# Altium project PROJECT_CONTROL_DC.PrjPCB
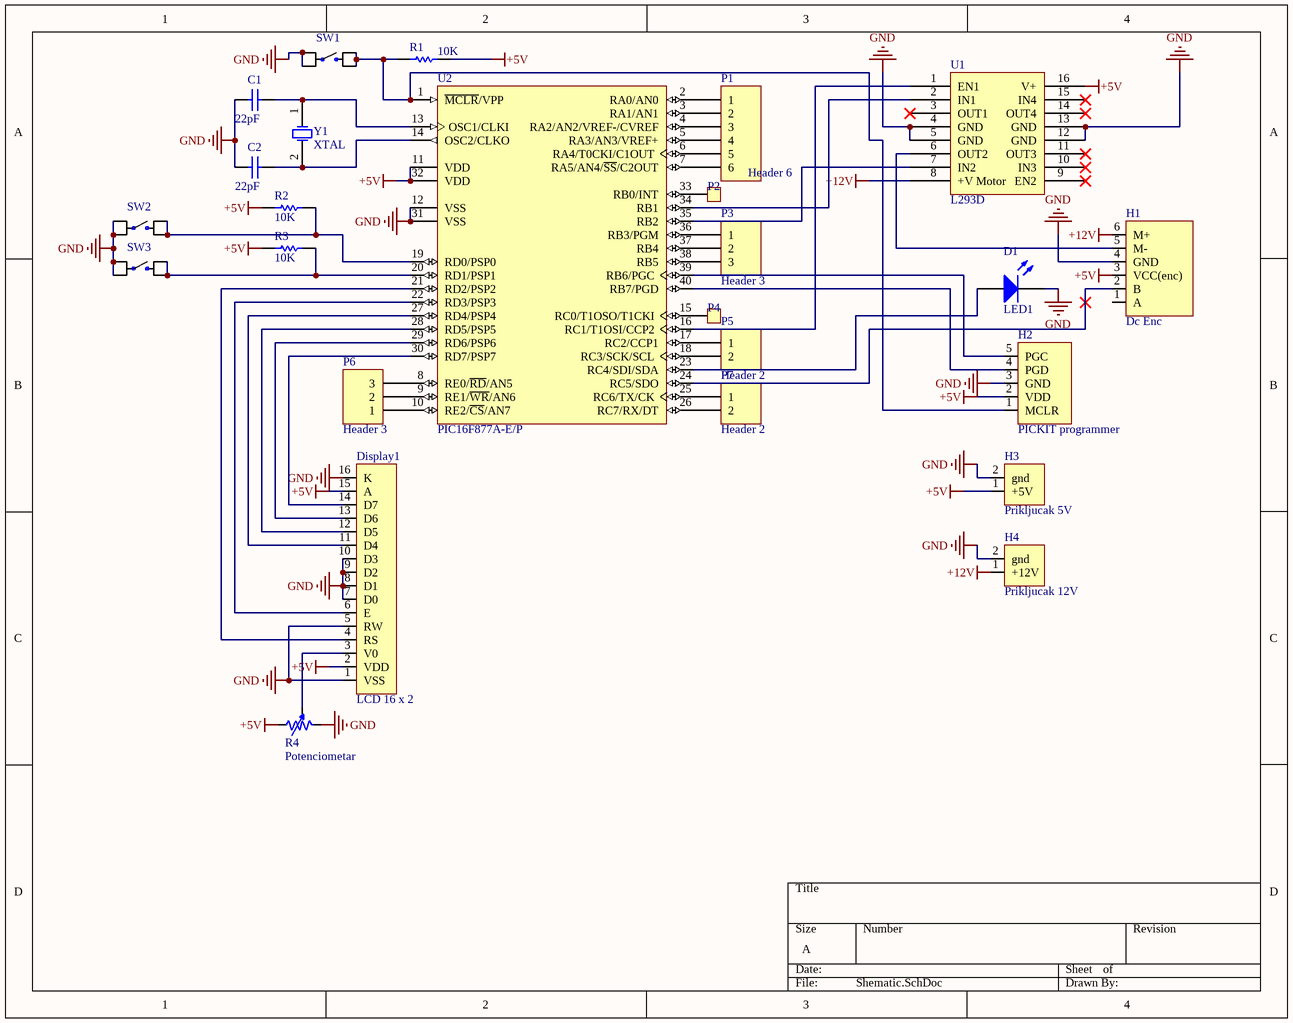
[diagram p0: Shematic.SchDoc]
1 sheet, 25 parts. Net scope: global (net labels, ports and power ports of the same name join across sheets).
Board file: PCB.PcbDoc

## Sheet Shematic.SchDoc
size A

### Parts
C1  value 22pF  [RAD-0.3]  (hidden comment: Cap)
C2  value 22pF  [RAD-0.3]  (hidden comment: Cap)
D1  LED1  [LED-1]
Display1  LCD 16 x 2  [LCD16x2]
H1  Dc Enc
H2  PICKIT programmer  [Pickit]
H3  Prikljucak 5V  [H 5V]
H4  Prikljucak 12V  [H 12V]
P1  Header 6  [HDR1X6]
P2  Header 1  [Header 1]  (value not drawn)
P3  Header 3  [HDR1X3]
P4  Header 1  [Header 1]  (value not drawn)
P5  Header 2  [HDR1X2]
P6  Header 3  [HDR1X3]
P7  Header 2  [HDR1X2]
R1  value 10K  [AXIAL-0.3]  (hidden comment: Res1)
R2  value 10K  [AXIAL-0.3]  (hidden comment: Res1)
R3  value 10K  [AXIAL-0.3]  (hidden comment: Res1)
R4  Potenciometar  [ADJ_RES]
SW1  2-1437565-8  [*SW_SMD_2-1437565-8_4_4.50_6.00_6.00_5.00]  (value not drawn)
SW2  2-1437565-8  [*SW_SMD_2-1437565-8_4_4.50_6.00_6.00_5.00]  (value not drawn)
SW3  2-1437565-8  [*SW_SMD_2-1437565-8_4_4.50_6.00_6.00_5.00]  (value not drawn)
U1  L293D  [*DIP880W50P254L2000H510Q16]
U2  PIC16F877A-E/P  [*DIP254P1524X483-40]
Y1  XTAL  [R38]

### Nets
+5V: Display1.2(VDD) Display1.15(A) H1.3(VCC(enc)) H2.2(VDD) H3.1(+5V) R1.2 R2.2 R3.2 R4.1 U1.16(V+) U2.11(VDD) U2.32(VDD)
+12V: H1.6(M+) H4.1(+12V) U1.8(+V_Motor)
GND: C1.1 C2.1 D1.2(K) Display1.1(VSS) Display1.5(RW) Display1.7(D0) Display1.8(D1) Display1.9(D2) Display1.10(D3) Display1.16(K) H1.4(GND) H2.3(GND) H3.2(gnd) H4.2(gnd) R4.2 SW1.1 SW1.2 SW2.1 SW2.2 SW3.1 SW3.2 U1.4(GND) U1.5(GND) U1.12(GND) U1.13(GND) U2.12(VSS) U2.31(VSS)
NetC1_2: C1.2 U2.13(OSC1/CLKI) Y1.1(OSC1)
NetC2_2: C2.2 U2.14(OSC2/CLKO) Y1.2(OSC2)
NetD1_1: D1.1(A) U2.23(RC4/SDI/SDA)
NetDisplay1_3: Display1.3(V0) R4.3
NetDisplay1_4: Display1.4(RS) U2.21(RD2/PSP2)
NetDisplay1_6: Display1.6(E) U2.22(RD3/PSP3)
NetDisplay1_11: Display1.11(D4) U2.27(RD4/PSP4)
NetDisplay1_12: Display1.12(D5) U2.28(RD5/PSP5)
NetDisplay1_13: Display1.13(D6) U2.29(RD6/PSP6)
NetDisplay1_14: Display1.14(D7) U2.30(RD7/PSP7)
NetH1_2: H1.2(B) U2.24(RC5/SDO)
NetH1_5: H1.5(M-) U1.6(OUT2)
NetH2_1: H2.1(MCLR) R1.1 SW1.3 SW1.4 U2.1(~{MCLR}/VPP)
NetH2_4: H2.4(PGD) U2.40(RB7/PGD)
NetH2_5: H2.5(PGC) U2.39(RB6/PGC)
NetP1_1: P1.1 U2.2(RA0/AN0)
NetP1_2: P1.2 U2.3(RA1/AN1)
NetP1_3: P1.3 U2.4(RA2/AN2/VREF-/CVREF)
NetP1_4: P1.4 U2.5(RA3/AN3/VREF+)
NetP1_5: P1.5 U2.6(RA4/T0CKI/C1OUT)
NetP1_6: P1.6 U2.7(RA5/AN4/~{SS}/C2OUT)
NetP2_1: P2.1 U2.33(RB0/INT)
NetP3_1: P3.1 U2.36(RB3/PGM)
NetP3_2: P3.2 U2.37(RB4)
NetP3_3: P3.3 U2.38(RB5)
NetP4_1: P4.1 U2.15(RC0/T1OSO/T1CKI)
NetP5_1: P5.1 U2.17(RC2/CCP1)
NetP5_2: P5.2 U2.18(RC3/SCK/SCL)
NetP6_1: P6.1 U2.10(RE2/~{CS}/AN7)
NetP6_2: P6.2 U2.9(RE1/~{WR}/AN6)
NetP6_3: P6.3 U2.8(RE0/~{RD}/AN5)
NetP7_1: P7.1 U2.25(RC6/TX/CK)
NetP7_2: P7.2 U2.26(RC7/RX/DT)
NetR2_1: R2.1 SW2.3 SW2.4 U2.19(RD0/PSP0)
NetR3_1: R3.1 SW3.3 SW3.4 U2.20(RD1/PSP1)
NetU1_1: U1.1(EN1) U2.16(RC1/T1OSI/CCP2)
NetU1_2: U1.2(IN1) U2.34(RB1)
NetU1_7: U1.7(IN2) U2.35(RB2)

Not connected (* = marked no-connect by the designer): H1 1(A); U1 3(OUT1)* 9(EN2)* 10(IN3)* 11(OUT3)* 14(OUT4)* 15(IN4)*

### Library data of the parts
C1 C2 = Cap: Capacitor; Published: 8-Jun-2000; LatestRevisionDate: 17-Jul-2002; LatestRevisionNote: Re-released for DXP Platform.; PackageReference: RAD-0.3; Publisher: Altium Limited; PackageDescription: Radial Cap, Thru-Hole; 2 Leads; 0.3 in Pin Spacing
D1 = LED1: Typical RED GaAs LED; Published: 8-Jun-2000; LatestRevisionDate: 08-Jul-2005; LatestRevisionNote: Mech Layer 1 removed.; PackageReference: LED-1; Publisher: Altium Limited; PackageDescription: LED; 2 Leads
H1 = Header DC & ENC
H2 = PICKIT HEADER
H3 = Header 5V
H4 = Header 12V
P1 = Header 6: Header, 6-Pin; LatestRevisionDate: 17-Jul-2002; LatestRevisionNote: Re-released for DXP Platform.; Publisher: Altium Limited
P3 P6 = Header 3: Header, 3-Pin; LatestRevisionDate: 17-Jul-2002; LatestRevisionNote: Re-released for DXP Platform.; Publisher: Altium Limited
P5 P7 = Header 2: Header, 2-Pin; LatestRevisionDate: 17-Jul-2002; LatestRevisionNote: Re-released for DXP Platform.; Publisher: Altium Limited
R1-R3 = Res1: Resistor; Published: 8-Jun-2000; LatestRevisionDate: 17-Jul-2002; LatestRevisionNote: Re-released for DXP Platform.; PackageReference: AXIAL-0.3; Publisher: Altium Limited; PackageDescription: Axial Device, Thru-Hole; 2 Leads; 0.3 in Pin Spacing
R4 = ADJ_RES
SW1-SW3 = 2-1437565-8: Tactile Switch SPST-NO Top Actuated Surface Mount; Configuration_Pole-Throw: Single Pole - Single Throw; MF: TE Connectivity; Contact_Current_Rating: 50 mA; Package: None; TE_purchase_URL: https://www.te.com/usa-en/product-2-1437565-8.html?te_bu=Cor&te_type=disp&te_campaign=seda_glo_cor-seda-global-disp-prtnr-fy19-seda-model-bom-cta_sma-317_1&elqCampaignId=32493; MP: 2-1437565-8; Price: None; SnapEDA_Link: https://www.snapeda.com/parts/2-1437565-8/TE%20Connectivity%20ALCOSWITCH%20Switches/view-part/455292/?ref=snap; Availability: Unavailable; Value: *
U1 = L293D: Motor Driver
U2 = PIC16F877A-E/P: Enhanced FLASH Microcontroller, 8K (x14-Bit words) FLASH, 368 Bytes RAM, 40-Pin PDIP, Standard VDD Range, Extended Temperature; ComponentAvailability: Unknown. Contact manufacturer to determine status.; Published: 11-Oct-2004; LatestRevisionDate: 29-Jan-2009; LatestRevisionNote: Sch. layout revised. 3D Model Removed.; DatasheetVersion: revB, Oct-2003; PackageVersion: revBB, Aug-2009; PackageReference: PDIP600-P40; Publisher: Altium Limited; PackageDescription: 40-Lead Plastic Dual In-Line (P) - 600 mil Body [PDIP]; Supplier 1: Digi-Key; Supplier Part Number 1: PIC16F877A-E/P-ND; Supplier 2: Farnell; Supplier Part Number 2: 1567990; ComponentLink1Description: Datasheet; ComponentLink1URL: http://ww1.microchip.com/downloads/en/DeviceDoc/39582b.pdf; ComponentLink2Description: Packaging Specification; ComponentLink2URL: http://www.microchip.com/stellent/groups/techpub_sg/documents/packagingspec/en012702.pdf; ComponentLink3Description: Microchip.com Home; ComponentLink3URL: http://www.microchip.com/
Y1 = XTAL: Crystal Oscillator; Published: 8-Jun-2000; LatestRevisionDate: 17-Jul-2002; LatestRevisionNote: Re-released for DXP Platform.; PackageReference: R38; Publisher: Altium Limited; PackageDescription: Crystal, Thru-Hole; 2 Leads; Body 3.1 x 8.2 mm (Dia.xH)